# EAGLE schematic WiazkaSwiatlaPrzod (EAGLE 7.7.0)
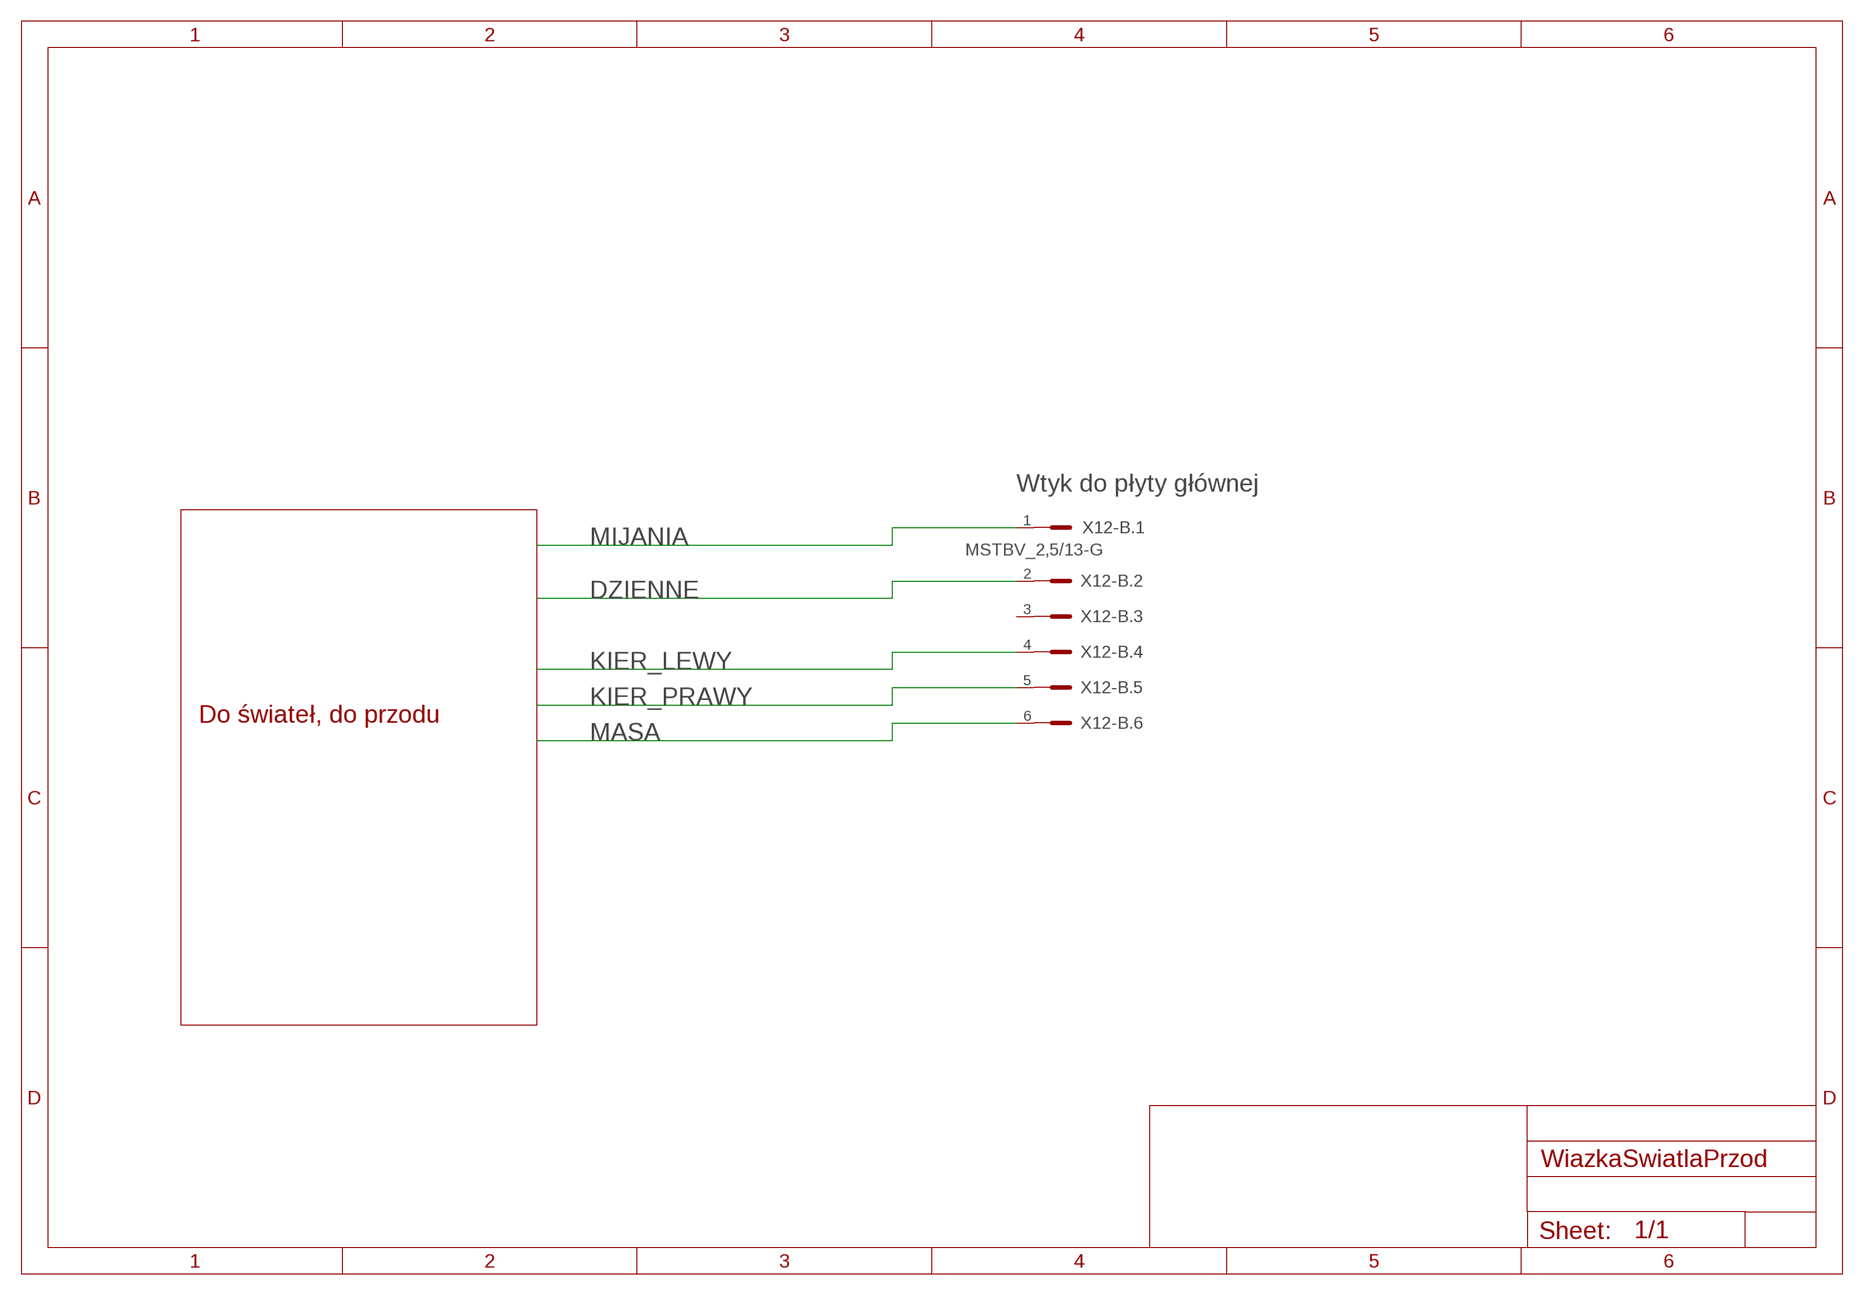
[diagram p0: schematic, sheet 1]

## Parts
X12-B  MSTBV_2,5/13-G  [MSTBV_2,5/13-G]

## Nets
DZIENNE: X12-B.2
KIER_LEWY: X12-B.4
KIER_PRAWY: X12-B.5
MASA: X12-B.6
MIJANIA: X12-B.1
Unconnected: X12-B.3 X12-B.7 X12-B.8 X12-B.9 X12-B.10 X12-B.11 X12-B.12 X12-B.13

## Notes on the sheet
- Wtyk do płyty głównej
- Do świateł, do przodu

## Library data of the parts
X12-B = con-phoenix-500:MSTBV_2,5/13-G: Grundleiste - MSTBV 2,5/13-G - 1753657 Grundgehäuse, Nennstrom: 12 A Bemessungsspannung (III/2): 320 V Polzahl: 13 Rastermaß: 5 mm Farbe: grün Kontaktoberfläche: Zinn Montage: Löten